# EAGLE schematic Beunboard_rev1 (EAGLE 9.5.2)
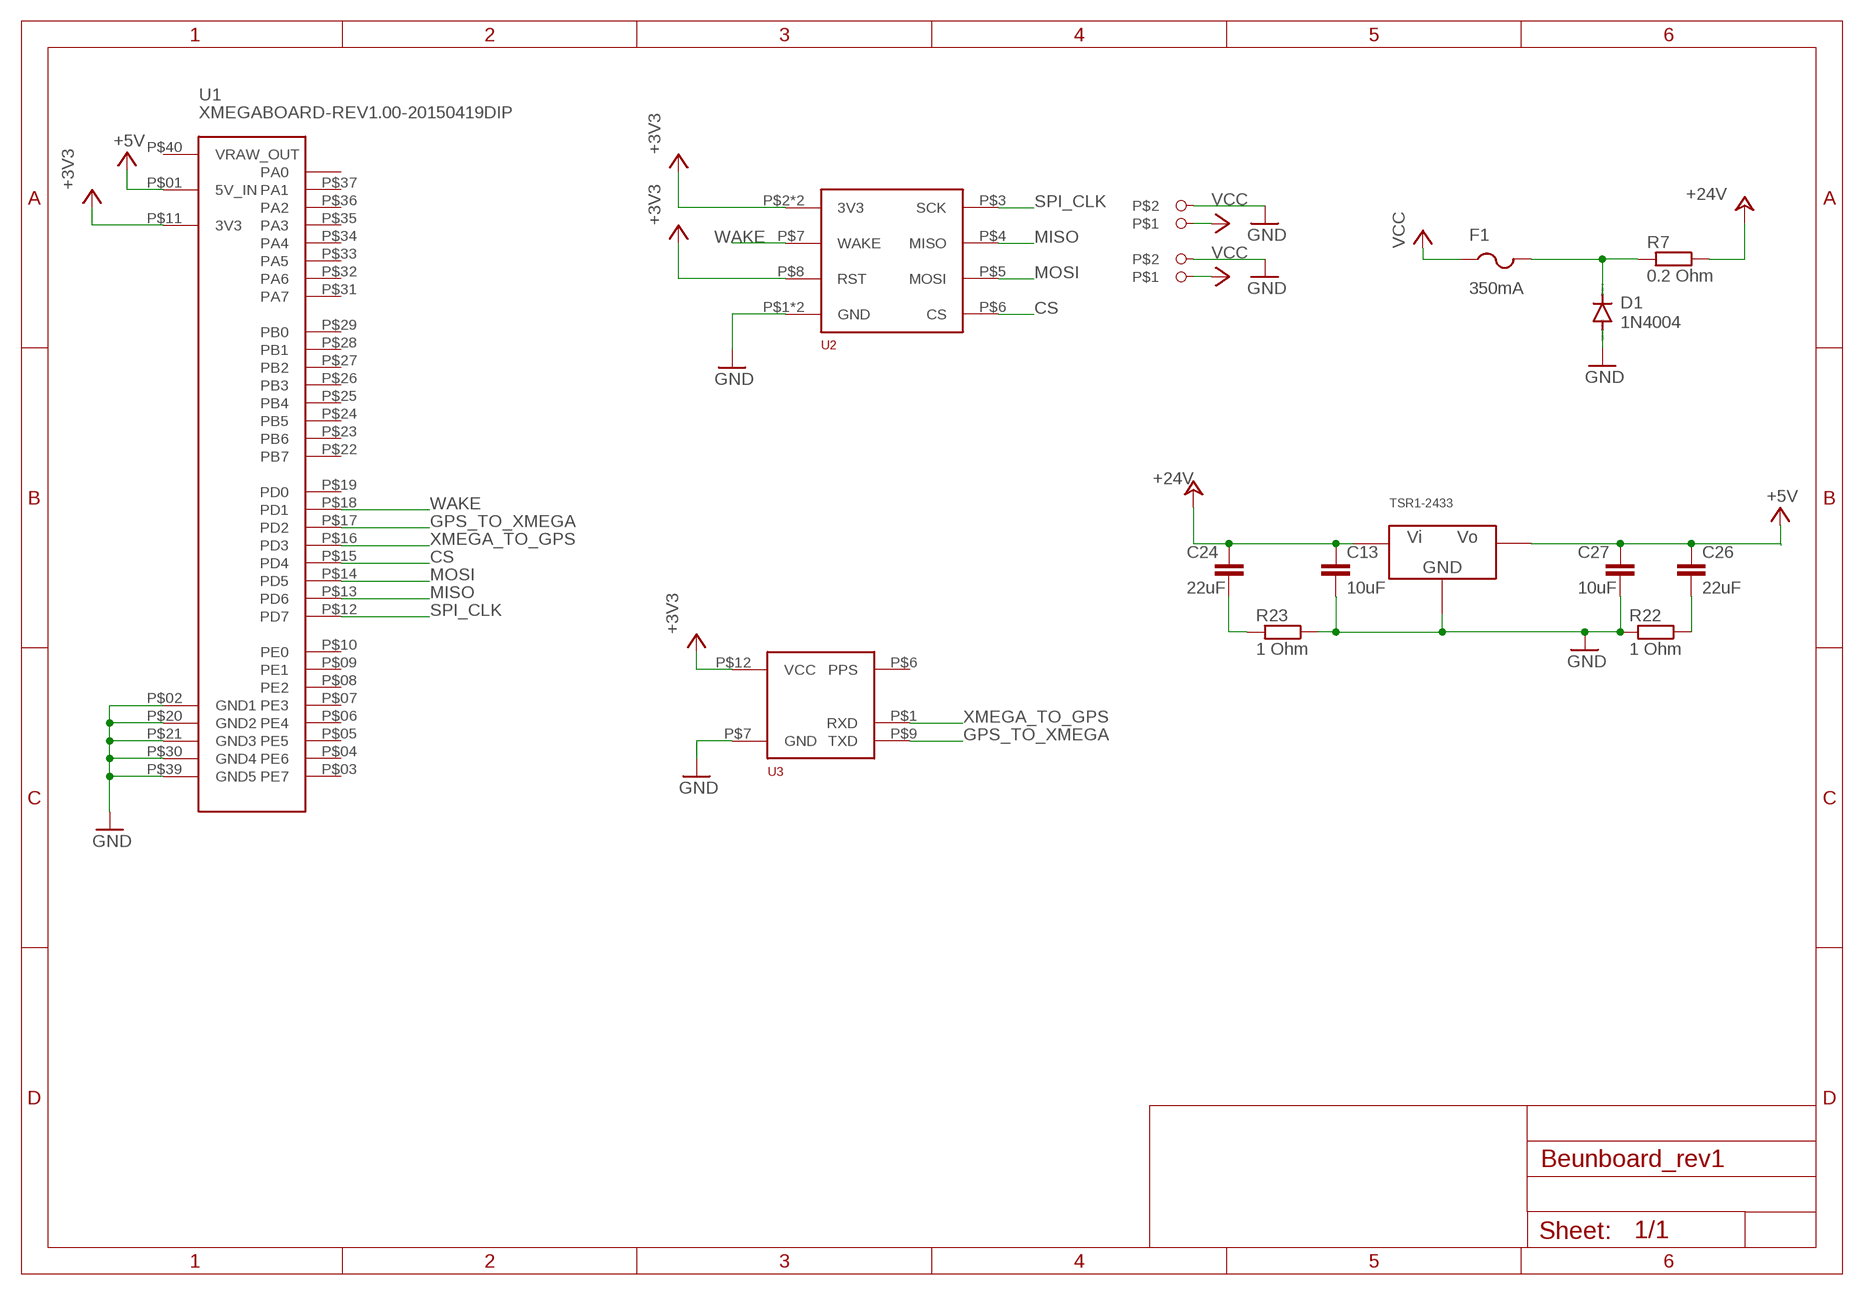
[diagram p0: schematic, sheet 1]

## Parts
C13  10uF  C-EUC1206  [C1206]
C24  22uF  C-EUC1206  [C1206]
C26  22uF  C-EUC1206  [C1206]
C27  10uF  C-EUC1206  [C1206]
D1  1N4004  [DO41-10]
F1  350mA  PTCFUSE-1206  [R1206]
POWER1  CON_3.81MM2_SIDE  [CON_3.81MM2_SIDE]
POWER2  CON_3.81MM2_SIDE  [CON_3.81MM2_SIDE]
R7  0.2 Ohm  R-EU_R0805  [R0805]
R22  1 Ohm  R-EU_R0805  [R0805]
R23  1 Ohm  R-EU_R0805  [R0805]
TSR1-2433  TSR1-2433  [TSR1-2433]
U1  XMEGABOARD-REV1.00-20150419DIP  [XMEGABOARD-REV1.00-20150419]
U2  SPARKFUN_BNO080SPARKFUN_BNO080  [SPARKFUN_BNO080]
U3  NAVSPARK_MININAVSPARK_MINI  [NAVSPARK_MINI]

## Nets
+3V3: U1.P$11(3V3) U2.P$2(3V3) U2.P$8(RST) U2.P$18(3V3) U3.P$12(VCC)
+5V: C26.1 C27.1 TSR1-2433.VO U1.P$01(5V_IN)
+24V [24v]: C13.1 C24.1 R7.1 TSR1-2433.VI
CS: U1.P$15(PD4) U2.P$6(CS)
GND: C13.2 C27.2 D1.A POWER1.P$2 POWER2.P$2 R22.2 R23.1 TSR1-2433.GND U1.P$02(GND1) U1.P$20(GND2) U1.P$21(GND3) U1.P$30(GND4) U1.P$39(GND5) U2.P$1(GND) U2.P$17(GND) U3.P$7(GND)
GPS_TO_XMEGA: U1.P$17(PD2) U3.P$9(TXD)
MISO: U1.P$13(PD6) U2.P$4(MISO)
MOSI: U1.P$14(PD5) U2.P$5(MOSI)
N$2: C26.2 R22.1
N$25: C24.2 R23.2
N$37: D1.C F1.2 R7.2
SPI_CLK: U1.P$12(PD7) U2.P$3(SCK)
VCC [VCC]: F1.1 POWER1.P$1 POWER2.P$1
WAKE: U1.P$18(PD1) U2.P$7(WAKE)
XMEGA_TO_GPS: U1.P$16(PD3) U3.P$1(RXD)
Unconnected: U1.P$03(PE7) U1.P$04(PE6) U1.P$05(PE5) U1.P$06(PE4) U1.P$07(PE3) U1.P$08(PE2) U1.P$09(PE1) U1.P$10(PE0) U1.P$19(PD0) U1.P$22(PB7) U1.P$23(PB6) U1.P$24(PB5) U1.P$25(PB4) U1.P$26(PB3) U1.P$27(PB2) U1.P$28(PB1) U1.P$29(PB0) U1.P$31(PA7) U1.P$32(PA6) U1.P$33(PA5) U1.P$34(PA4) U1.P$35(PA3) U1.P$36(PA2) U1.P$37(PA1) U1.P$38(PA0) U1.P$40(VRAW_OUT) U3.P$6(PPS)

## Notes on the sheet
- Power

## Library data of the parts
C13 C24 C26 C27 = rcl:C-EU: CAPACITOR, European symbol; SPICEPREFIX: C
D1 = diode:1N4004: DIODE general purpose rectifier, 1 A
F1 = adafruit:PTCFUSE: PTC fuses, resettable thermistors
POWER1 POWER2 = Phoenix-con:CON_3.81MM2_SIDE
R7 R22 R23 = rcl:R-EU_: RESISTOR, European symbol; SPICEPREFIX: R
TSR1-2433 = tracopower:TSR1-2433
U1 = HVA-IC:XMEGABOARD-REV1.00-20150419
U2 = SPARKFUN_BNO080:SPARKFUN_BNO080
U3 = NAVSPARK_MINI:NAVSPARK_MINI

## Net classes
0 default: width 0.2 mm, drill 0.3 mm, clearance 0.2 mm
1 3V3: width 0.5 mm, drill 0.3 mm, clearance 0.2 mm to class 0
3 24v: width 1 mm, drill 0.5 mm, clearance 0.2 mm to class 0
4 VCC: width 1 mm, clearance 0.2 mm to class 0